# EAGLE design femtoUSB_r1.0.1-rgb (EAGLE 7.5.0)
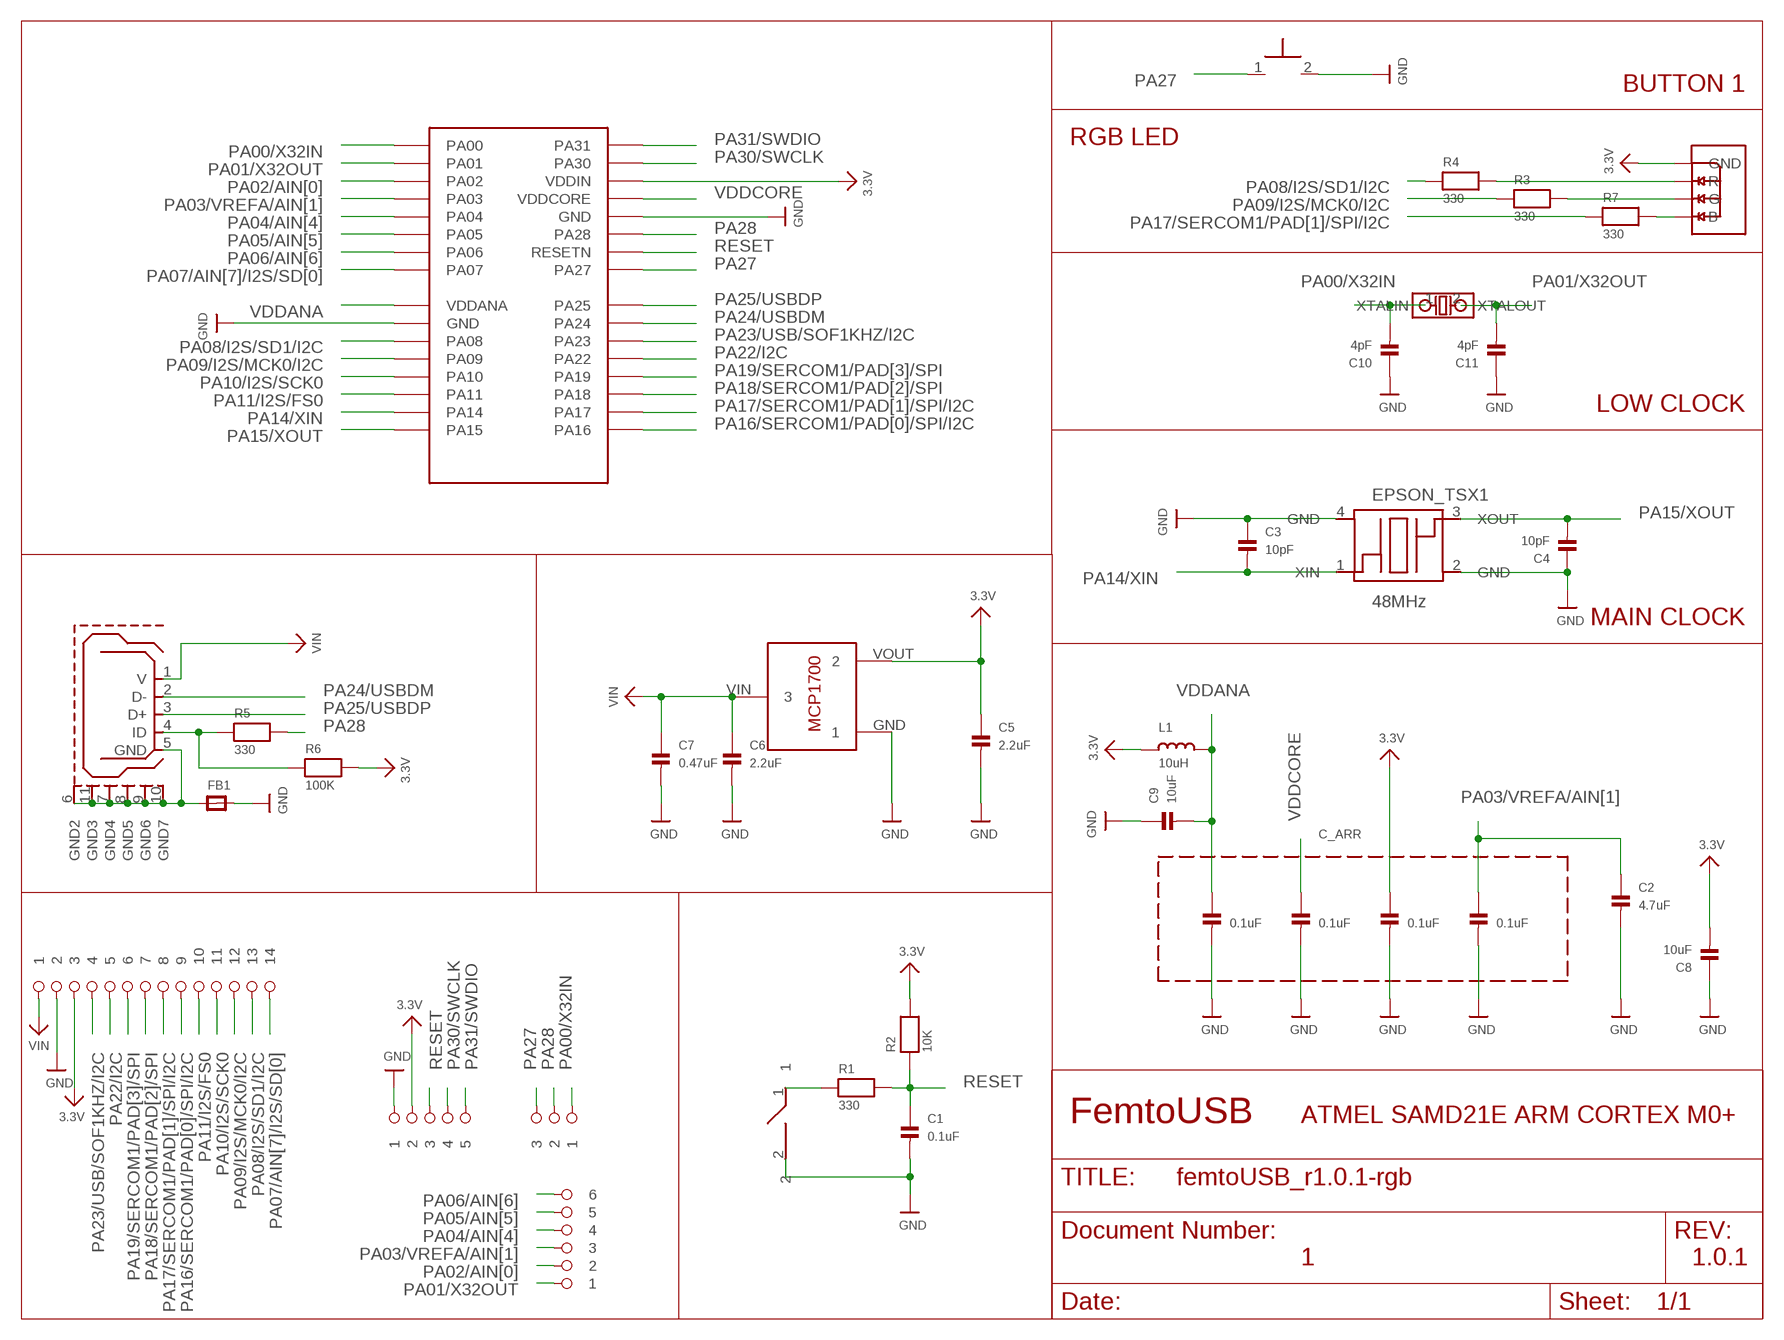
[diagram p0: schematic, sheet 1]

## Parts
BTN_BOOT  TACTILE_SWITCH_NO_GND_NO_BOSS  [SIDE_ACT_NO_GND_NO_BOSS]
C1  0.1uF  CAP_CERAMIC_0402MP  [_0402MP]
C2  4.7uF  CAP_CERAMIC_0402MP  [_0402MP]
C3  10pF  CAP_CERAMIC_0402MP  [_0402MP]
C4  10pF  CAP_CERAMIC_0402MP  [_0402MP]
C5  2.2uF  CAP_CERAMIC_0402MP  [_0402MP]
C6  2.2uF  CAP_CERAMIC_0402MP  [_0402MP]
C7  0.47uF  CAP_CERAMIC_0402MP  [_0402MP]
C8  10uF  CAP_CERAMIC_0402MP  [_0402MP]
C9  10uF  CAP_CERAMIC_0402MP  [_0402MP]
C10  4pF  CAP_CERAMIC_0402MP  [_0402MP]
C11  4pF  CAP_CERAMIC_0402MP  [_0402MP]
C_ARR  0.1uF  KEMET_CERAMIC_CAPACITOR_ARRAY_1X4  [CAPACITOR_ARRAY_1206_MONO_1X4]
EPSON_TSX1  48MHz  TSX-3225  [TSX-3225]
FB1  FERRITE_0603MP  [_0603MP]
IC1  ATSAMD21E18A-MUT  [QFN32]
L1  10uH  INDUCTOR_0603MP  [_0603MP]
LDO_VREG  MCP1700T-3302E/TT  [MCP1700T-3302E/TT]
MICRO_B_USB  USB_MICROB  [USB_MICROB_PACKAGE]
OSC32K  ABS06-107-32.768KHZ-T  [ABS06-107-32.768KHZ-T]
PIN_1X3  1X3_ROUND  [1X3_ROUND]
PIN_1X5  1X5_ROUND  [1X5_ROUND]
PIN_1X6  1X6_ROUND  [1X6_ROUND]
PIN_1X14  1X14_ROUND  [1X14_ROUND]
R1  330  RESISTOR_0402MP  [_0402MP]
R2  10K  RESISTOR_0402MP  [_0402MP]
R3  330  RESISTOR_0402MP  [_0402MP]
R4  330  RESISTOR_0402MP  [_0402MP]
R5  330  RESISTOR_0402MP  [_0402MP]
R6  100K  RESISTOR_0402MP  [_0402MP]
R7  330  RESISTOR_0402MP  [_0402MP]
RGBLED  LRTB_R48G  [LRTB_R48G]
SJ_RESET  SPST_SMD  [SPST_SMD]

## Nets
3.3V: C5.1 C8.2 C_ARR.5 IC1.30(VDDIN) L1.1 LDO_VREG.VOUT PIN_1X5.P$2 PIN_1X14.P$3 R2.2 R6.2 RGBLED.1(GND)
GND: BTN_BOOT.2 C1.2 C2.2 C3.1 C4.1 C5.2 C6.2 C7.2 C8.1 C9.1 C10.1 C11.1 C_ARR.2 C_ARR.4 C_ARR.6 C_ARR.8 EPSON_TSX1.2(GND) EPSON_TSX1.4(GND) FB1.2 IC1.10(GND) IC1.28(GND) LDO_VREG.GND PIN_1X5.P$1 PIN_1X14.P$2 SJ_RESET.2
N$3: MICRO_B_USB.4(ID) R5.1 R6.1
N$26: R1.1 SJ_RESET.1
N$32: FB1.1 MICRO_B_USB.5(GND) MICRO_B_USB.6(GND2) MICRO_B_USB.7(GND4) MICRO_B_USB.8(GND5) MICRO_B_USB.9(GND6) MICRO_B_USB.10(GND7) MICRO_B_USB.11(GND3)
PA00/X32IN: C10.2 IC1.1(PA00) OSC32K.1(XTALIN) PIN_1X3.P$1
PA01/X32OUT: C11.2 IC1.2(PA01) OSC32K.2(XTALOUT) PIN_1X6.P$1
PA02/AIN[0]: IC1.3(PA02) PIN_1X6.P$2
PA03/VREFA/AIN[1]: C2.1 C_ARR.7 IC1.4(PA03) PIN_1X6.P$3
PA04/AIN[4]: IC1.5(PA04) PIN_1X6.P$4
PA05/AIN[5]: IC1.6(PA05) PIN_1X6.P$5
PA06/AIN[6]: IC1.7(PA06) PIN_1X6.P$6
PA07/AIN[7]/I2S/SD[0]: IC1.8(PA07) PIN_1X14.P$14
PA08/I2S/SD1/I2C: IC1.11(PA08) PIN_1X14.P$13 R4.1
PA08_R: R4.2 RGBLED.2(R)
PA09/I2S/MCK0/I2C: IC1.12(PA09) PIN_1X14.P$12 R3.1
PA09_G: R3.2 RGBLED.3(G)
PA10/I2S/SCK0: IC1.13(PA10) PIN_1X14.P$11
PA11/I2S/FS0: IC1.14(PA11) PIN_1X14.P$10
PA14/XIN: C3.2 EPSON_TSX1.1(XIN) IC1.15(PA14)
PA15/XOUT: C4.2 EPSON_TSX1.3(XOUT) IC1.16(PA15)
PA16/SERCOM1/PAD[0]/SPI/I2C: IC1.17(PA16) PIN_1X14.P$9
PA17/SERCOM1/PAD[1]/SPI/I2C: IC1.18(PA17) PIN_1X14.P$8 R7.1
PA17_B: R7.2 RGBLED.4(B)
PA18/SERCOM1/PAD[2]/SPI: IC1.19(PA18) PIN_1X14.P$7
PA19/SERCOM1/PAD[3]/SPI: IC1.20(PA19) PIN_1X14.P$6
PA22/I2C: IC1.21(PA22) PIN_1X14.P$5
PA23/USB/SOF1KHZ/I2C: IC1.22(PA23) PIN_1X14.P$4
PA24/USBDM: IC1.23(PA24) MICRO_B_USB.2(D-)
PA25/USBDP: IC1.24(PA25) MICRO_B_USB.3(D+)
PA27: BTN_BOOT.1 IC1.25(PA27) PIN_1X3.P$3
PA28: IC1.27(PA28) PIN_1X3.P$2 R5.2
PA30/SWCLK: IC1.31(PA30) PIN_1X5.P$4
PA31/SWDIO: IC1.32(PA31) PIN_1X5.P$5
RESET: C1.1 IC1.26(RESETN) PIN_1X5.P$3 R1.2 R2.1
VDDANA: C9.2 C_ARR.1 IC1.9(VDDANA) L1.2
VDDCORE: C_ARR.3 IC1.29(VDDCORE)
VIN: C6.1 C7.1 LDO_VREG.VIN MICRO_B_USB.1(V) PIN_1X14.P$1

## Notes on the sheet
- BUTTON 1
- RGB LED
- LOW CLOCK
- MAIN CLOCK
- FemtoUSB | ATMEL SAMD21E ARM CORTEX M0+
- 1 | 1.0.1

## Library data of the parts
BTN_BOOT = omron_tactile_switch:TACTILE_SWITCH_NO_GND_NO_BOSS; MFR_ID: B3U-3000PM
C1 = microbuilder:CAP_CERAMIC: Ceramic Capacitors 0402 - 0402 Surface Mount Capacitors 16pF 50V 5% [Digikey: 445-4899-2-ND] 18pF 50V 5% [Digikey: 490-1281-2-ND] 22pF 50V 5% [Digikey: 490-1283-2-ND] 68pF 50V 5% [Digikey: 490-1289-2-ND] 0.1uF 10V 10% [Digikey: 490-1318-2-ND] 1.0uF 6.3V 10% [Digikey: 490-1320-2-ND] 0603 - 0603 Surface Mount Capacitors 16 pF 50V 5% [Digikey: 445-5051-2-ND] 22 pF 50V [Digikey: PCC220ACVTR-ND] 33 pF 50V 5% [Digikey: 490-1415-1-ND] 56pF 50V 5% [Digikey: 490-1421-1-ND] 220pF 50V 5% [Digikey: 445-1285-1-ND] 680 pF 50V 2200 pF 50V 5% C0G [Digikey: 445-1297-1-ND] 5600 pF 100V 5% X7R [Digikey: 478-3711-1-ND] 0.1 µF 25V 10% [Digikey: PCC2277TR-ND] 0.22 µF 16V 10% X7R [Digikey: 445-1318-1-ND] 1.0 µF 25V 10% [Digikey: 445-5146-2-ND] 0603 - RF Specific 3pF 250V +/-0.1pF RF [Digikey: 712-1347-1-ND] 18 pF 250V 5% [Digikey: 478-3505-1-ND or 712-1322-1-ND] 56 pF 250V 5% C0G RF [Digikey: 490-4867-1-ND] 68 pF 250V RF [Digikey: 490-4868-1-ND] 0805 - 0805 Surface Mount Capacitors 220 pF 250V 2% RF Ceramic Capacitor [Digikey: 712-1398-1-ND] 1000 pF 50V 2% NP0 Ceramic Capacitor [Digikey: 478-3760-1-ND] 0.1 µF 25V 10% Ceramic Capacitor [Digikey: PCC1828TR-ND] 1.0 µF 16V 10% Ceramic Capacitor[Digikey: 490-1691-2-ND] 10.0 µF 10V 10% Ceramic Capacitor[Digikey: 709-1228-1-ND] 10.0 uF 16V 10% Ceramic Capacitor [Digikey: 478-5165-2-ND] 47 uF 6.3V 20% Ceramic Capacitor [Digikey: 587-1779-1-ND or 399-5506-1-ND] 1206 - 1206 Surface Mount Capacitors 47uF 10V 20% Ceramic Capacitor [Digikey: 490-5528-1-ND or 399-5508-1-ND or 445-6010-1-ND] 100uF 6.3V -20%, +80% Y5V Ceramic Capacitor (Digikey: 490-4512-1-ND, Mouser: 81-GRM31CF50J107ZE1L); MFR_ID: C1005X7R1A104K050BB
C2 = microbuilder:CAP_CERAMIC: Ceramic Capacitors 0402 - 0402 Surface Mount Capacitors 16pF 50V 5% [Digikey: 445-4899-2-ND] 18pF 50V 5% [Digikey: 490-1281-2-ND] 22pF 50V 5% [Digikey: 490-1283-2-ND] 68pF 50V 5% [Digikey: 490-1289-2-ND] 0.1uF 10V 10% [Digikey: 490-1318-2-ND] 1.0uF 6.3V 10% [Digikey: 490-1320-2-ND] 0603 - 0603 Surface Mount Capacitors 16 pF 50V 5% [Digikey: 445-5051-2-ND] 22 pF 50V [Digikey: PCC220ACVTR-ND] 33 pF 50V 5% [Digikey: 490-1415-1-ND] 56pF 50V 5% [Digikey: 490-1421-1-ND] 220pF 50V 5% [Digikey: 445-1285-1-ND] 680 pF 50V 2200 pF 50V 5% C0G [Digikey: 445-1297-1-ND] 5600 pF 100V 5% X7R [Digikey: 478-3711-1-ND] 0.1 µF 25V 10% [Digikey: PCC2277TR-ND] 0.22 µF 16V 10% X7R [Digikey: 445-1318-1-ND] 1.0 µF 25V 10% [Digikey: 445-5146-2-ND] 0603 - RF Specific 3pF 250V +/-0.1pF RF [Digikey: 712-1347-1-ND] 18 pF 250V 5% [Digikey: 478-3505-1-ND or 712-1322-1-ND] 56 pF 250V 5% C0G RF [Digikey: 490-4867-1-ND] 68 pF 250V RF [Digikey: 490-4868-1-ND] 0805 - 0805 Surface Mount Capacitors 220 pF 250V 2% RF Ceramic Capacitor [Digikey: 712-1398-1-ND] 1000 pF 50V 2% NP0 Ceramic Capacitor [Digikey: 478-3760-1-ND] 0.1 µF 25V 10% Ceramic Capacitor [Digikey: PCC1828TR-ND] 1.0 µF 16V 10% Ceramic Capacitor[Digikey: 490-1691-2-ND] 10.0 µF 10V 10% Ceramic Capacitor[Digikey: 709-1228-1-ND] 10.0 uF 16V 10% Ceramic Capacitor [Digikey: 478-5165-2-ND] 47 uF 6.3V 20% Ceramic Capacitor [Digikey: 587-1779-1-ND or 399-5506-1-ND] 1206 - 1206 Surface Mount Capacitors 47uF 10V 20% Ceramic Capacitor [Digikey: 490-5528-1-ND or 399-5508-1-ND or 445-6010-1-ND] 100uF 6.3V -20%, +80% Y5V Ceramic Capacitor (Digikey: 490-4512-1-ND, Mouser: 81-GRM31CF50J107ZE1L); MFR_ID: C1005X5R1A475K050BC
C3 C4 = microbuilder:CAP_CERAMIC: Ceramic Capacitors 0402 - 0402 Surface Mount Capacitors 16pF 50V 5% [Digikey: 445-4899-2-ND] 18pF 50V 5% [Digikey: 490-1281-2-ND] 22pF 50V 5% [Digikey: 490-1283-2-ND] 68pF 50V 5% [Digikey: 490-1289-2-ND] 0.1uF 10V 10% [Digikey: 490-1318-2-ND] 1.0uF 6.3V 10% [Digikey: 490-1320-2-ND] 0603 - 0603 Surface Mount Capacitors 16 pF 50V 5% [Digikey: 445-5051-2-ND] 22 pF 50V [Digikey: PCC220ACVTR-ND] 33 pF 50V 5% [Digikey: 490-1415-1-ND] 56pF 50V 5% [Digikey: 490-1421-1-ND] 220pF 50V 5% [Digikey: 445-1285-1-ND] 680 pF 50V 2200 pF 50V 5% C0G [Digikey: 445-1297-1-ND] 5600 pF 100V 5% X7R [Digikey: 478-3711-1-ND] 0.1 µF 25V 10% [Digikey: PCC2277TR-ND] 0.22 µF 16V 10% X7R [Digikey: 445-1318-1-ND] 1.0 µF 25V 10% [Digikey: 445-5146-2-ND] 0603 - RF Specific 3pF 250V +/-0.1pF RF [Digikey: 712-1347-1-ND] 18 pF 250V 5% [Digikey: 478-3505-1-ND or 712-1322-1-ND] 56 pF 250V 5% C0G RF [Digikey: 490-4867-1-ND] 68 pF 250V RF [Digikey: 490-4868-1-ND] 0805 - 0805 Surface Mount Capacitors 220 pF 250V 2% RF Ceramic Capacitor [Digikey: 712-1398-1-ND] 1000 pF 50V 2% NP0 Ceramic Capacitor [Digikey: 478-3760-1-ND] 0.1 µF 25V 10% Ceramic Capacitor [Digikey: PCC1828TR-ND] 1.0 µF 16V 10% Ceramic Capacitor[Digikey: 490-1691-2-ND] 10.0 µF 10V 10% Ceramic Capacitor[Digikey: 709-1228-1-ND] 10.0 uF 16V 10% Ceramic Capacitor [Digikey: 478-5165-2-ND] 47 uF 6.3V 20% Ceramic Capacitor [Digikey: 587-1779-1-ND or 399-5506-1-ND] 1206 - 1206 Surface Mount Capacitors 47uF 10V 20% Ceramic Capacitor [Digikey: 490-5528-1-ND or 399-5508-1-ND or 445-6010-1-ND] 100uF 6.3V -20%, +80% Y5V Ceramic Capacitor (Digikey: 490-4512-1-ND, Mouser: 81-GRM31CF50J107ZE1L); MFR_ID: VJ0402A100FXACW1BC
C5 C6 = microbuilder:CAP_CERAMIC: Ceramic Capacitors 0402 - 0402 Surface Mount Capacitors 16pF 50V 5% [Digikey: 445-4899-2-ND] 18pF 50V 5% [Digikey: 490-1281-2-ND] 22pF 50V 5% [Digikey: 490-1283-2-ND] 68pF 50V 5% [Digikey: 490-1289-2-ND] 0.1uF 10V 10% [Digikey: 490-1318-2-ND] 1.0uF 6.3V 10% [Digikey: 490-1320-2-ND] 0603 - 0603 Surface Mount Capacitors 16 pF 50V 5% [Digikey: 445-5051-2-ND] 22 pF 50V [Digikey: PCC220ACVTR-ND] 33 pF 50V 5% [Digikey: 490-1415-1-ND] 56pF 50V 5% [Digikey: 490-1421-1-ND] 220pF 50V 5% [Digikey: 445-1285-1-ND] 680 pF 50V 2200 pF 50V 5% C0G [Digikey: 445-1297-1-ND] 5600 pF 100V 5% X7R [Digikey: 478-3711-1-ND] 0.1 µF 25V 10% [Digikey: PCC2277TR-ND] 0.22 µF 16V 10% X7R [Digikey: 445-1318-1-ND] 1.0 µF 25V 10% [Digikey: 445-5146-2-ND] 0603 - RF Specific 3pF 250V +/-0.1pF RF [Digikey: 712-1347-1-ND] 18 pF 250V 5% [Digikey: 478-3505-1-ND or 712-1322-1-ND] 56 pF 250V 5% C0G RF [Digikey: 490-4867-1-ND] 68 pF 250V RF [Digikey: 490-4868-1-ND] 0805 - 0805 Surface Mount Capacitors 220 pF 250V 2% RF Ceramic Capacitor [Digikey: 712-1398-1-ND] 1000 pF 50V 2% NP0 Ceramic Capacitor [Digikey: 478-3760-1-ND] 0.1 µF 25V 10% Ceramic Capacitor [Digikey: PCC1828TR-ND] 1.0 µF 16V 10% Ceramic Capacitor[Digikey: 490-1691-2-ND] 10.0 µF 10V 10% Ceramic Capacitor[Digikey: 709-1228-1-ND] 10.0 uF 16V 10% Ceramic Capacitor [Digikey: 478-5165-2-ND] 47 uF 6.3V 20% Ceramic Capacitor [Digikey: 587-1779-1-ND or 399-5506-1-ND] 1206 - 1206 Surface Mount Capacitors 47uF 10V 20% Ceramic Capacitor [Digikey: 490-5528-1-ND or 399-5508-1-ND or 445-6010-1-ND] 100uF 6.3V -20%, +80% Y5V Ceramic Capacitor (Digikey: 490-4512-1-ND, Mouser: 81-GRM31CF50J107ZE1L); MFR_ID: C1005X5R1C225K050BC
C7 = microbuilder:CAP_CERAMIC: Ceramic Capacitors 0402 - 0402 Surface Mount Capacitors 16pF 50V 5% [Digikey: 445-4899-2-ND] 18pF 50V 5% [Digikey: 490-1281-2-ND] 22pF 50V 5% [Digikey: 490-1283-2-ND] 68pF 50V 5% [Digikey: 490-1289-2-ND] 0.1uF 10V 10% [Digikey: 490-1318-2-ND] 1.0uF 6.3V 10% [Digikey: 490-1320-2-ND] 0603 - 0603 Surface Mount Capacitors 16 pF 50V 5% [Digikey: 445-5051-2-ND] 22 pF 50V [Digikey: PCC220ACVTR-ND] 33 pF 50V 5% [Digikey: 490-1415-1-ND] 56pF 50V 5% [Digikey: 490-1421-1-ND] 220pF 50V 5% [Digikey: 445-1285-1-ND] 680 pF 50V 2200 pF 50V 5% C0G [Digikey: 445-1297-1-ND] 5600 pF 100V 5% X7R [Digikey: 478-3711-1-ND] 0.1 µF 25V 10% [Digikey: PCC2277TR-ND] 0.22 µF 16V 10% X7R [Digikey: 445-1318-1-ND] 1.0 µF 25V 10% [Digikey: 445-5146-2-ND] 0603 - RF Specific 3pF 250V +/-0.1pF RF [Digikey: 712-1347-1-ND] 18 pF 250V 5% [Digikey: 478-3505-1-ND or 712-1322-1-ND] 56 pF 250V 5% C0G RF [Digikey: 490-4867-1-ND] 68 pF 250V RF [Digikey: 490-4868-1-ND] 0805 - 0805 Surface Mount Capacitors 220 pF 250V 2% RF Ceramic Capacitor [Digikey: 712-1398-1-ND] 1000 pF 50V 2% NP0 Ceramic Capacitor [Digikey: 478-3760-1-ND] 0.1 µF 25V 10% Ceramic Capacitor [Digikey: PCC1828TR-ND] 1.0 µF 16V 10% Ceramic Capacitor[Digikey: 490-1691-2-ND] 10.0 µF 10V 10% Ceramic Capacitor[Digikey: 709-1228-1-ND] 10.0 uF 16V 10% Ceramic Capacitor [Digikey: 478-5165-2-ND] 47 uF 6.3V 20% Ceramic Capacitor [Digikey: 587-1779-1-ND or 399-5506-1-ND] 1206 - 1206 Surface Mount Capacitors 47uF 10V 20% Ceramic Capacitor [Digikey: 490-5528-1-ND or 399-5508-1-ND or 445-6010-1-ND] 100uF 6.3V -20%, +80% Y5V Ceramic Capacitor (Digikey: 490-4512-1-ND, Mouser: 81-GRM31CF50J107ZE1L); MFR_ID: C1005X5R1C474K050BC
C8 C9 = microbuilder:CAP_CERAMIC: Ceramic Capacitors 0402 - 0402 Surface Mount Capacitors 16pF 50V 5% [Digikey: 445-4899-2-ND] 18pF 50V 5% [Digikey: 490-1281-2-ND] 22pF 50V 5% [Digikey: 490-1283-2-ND] 68pF 50V 5% [Digikey: 490-1289-2-ND] 0.1uF 10V 10% [Digikey: 490-1318-2-ND] 1.0uF 6.3V 10% [Digikey: 490-1320-2-ND] 0603 - 0603 Surface Mount Capacitors 16 pF 50V 5% [Digikey: 445-5051-2-ND] 22 pF 50V [Digikey: PCC220ACVTR-ND] 33 pF 50V 5% [Digikey: 490-1415-1-ND] 56pF 50V 5% [Digikey: 490-1421-1-ND] 220pF 50V 5% [Digikey: 445-1285-1-ND] 680 pF 50V 2200 pF 50V 5% C0G [Digikey: 445-1297-1-ND] 5600 pF 100V 5% X7R [Digikey: 478-3711-1-ND] 0.1 µF 25V 10% [Digikey: PCC2277TR-ND] 0.22 µF 16V 10% X7R [Digikey: 445-1318-1-ND] 1.0 µF 25V 10% [Digikey: 445-5146-2-ND] 0603 - RF Specific 3pF 250V +/-0.1pF RF [Digikey: 712-1347-1-ND] 18 pF 250V 5% [Digikey: 478-3505-1-ND or 712-1322-1-ND] 56 pF 250V 5% C0G RF [Digikey: 490-4867-1-ND] 68 pF 250V RF [Digikey: 490-4868-1-ND] 0805 - 0805 Surface Mount Capacitors 220 pF 250V 2% RF Ceramic Capacitor [Digikey: 712-1398-1-ND] 1000 pF 50V 2% NP0 Ceramic Capacitor [Digikey: 478-3760-1-ND] 0.1 µF 25V 10% Ceramic Capacitor [Digikey: PCC1828TR-ND] 1.0 µF 16V 10% Ceramic Capacitor[Digikey: 490-1691-2-ND] 10.0 µF 10V 10% Ceramic Capacitor[Digikey: 709-1228-1-ND] 10.0 uF 16V 10% Ceramic Capacitor [Digikey: 478-5165-2-ND] 47 uF 6.3V 20% Ceramic Capacitor [Digikey: 587-1779-1-ND or 399-5506-1-ND] 1206 - 1206 Surface Mount Capacitors 47uF 10V 20% Ceramic Capacitor [Digikey: 490-5528-1-ND or 399-5508-1-ND or 445-6010-1-ND] 100uF 6.3V -20%, +80% Y5V Ceramic Capacitor (Digikey: 490-4512-1-ND, Mouser: 81-GRM31CF50J107ZE1L); MFR_ID: CL05A106MP5NUNC
C10 C11 = microbuilder:CAP_CERAMIC: Ceramic Capacitors 0402 - 0402 Surface Mount Capacitors 16pF 50V 5% [Digikey: 445-4899-2-ND] 18pF 50V 5% [Digikey: 490-1281-2-ND] 22pF 50V 5% [Digikey: 490-1283-2-ND] 68pF 50V 5% [Digikey: 490-1289-2-ND] 0.1uF 10V 10% [Digikey: 490-1318-2-ND] 1.0uF 6.3V 10% [Digikey: 490-1320-2-ND] 0603 - 0603 Surface Mount Capacitors 16 pF 50V 5% [Digikey: 445-5051-2-ND] 22 pF 50V [Digikey: PCC220ACVTR-ND] 33 pF 50V 5% [Digikey: 490-1415-1-ND] 56pF 50V 5% [Digikey: 490-1421-1-ND] 220pF 50V 5% [Digikey: 445-1285-1-ND] 680 pF 50V 2200 pF 50V 5% C0G [Digikey: 445-1297-1-ND] 5600 pF 100V 5% X7R [Digikey: 478-3711-1-ND] 0.1 µF 25V 10% [Digikey: PCC2277TR-ND] 0.22 µF 16V 10% X7R [Digikey: 445-1318-1-ND] 1.0 µF 25V 10% [Digikey: 445-5146-2-ND] 0603 - RF Specific 3pF 250V +/-0.1pF RF [Digikey: 712-1347-1-ND] 18 pF 250V 5% [Digikey: 478-3505-1-ND or 712-1322-1-ND] 56 pF 250V 5% C0G RF [Digikey: 490-4867-1-ND] 68 pF 250V RF [Digikey: 490-4868-1-ND] 0805 - 0805 Surface Mount Capacitors 220 pF 250V 2% RF Ceramic Capacitor [Digikey: 712-1398-1-ND] 1000 pF 50V 2% NP0 Ceramic Capacitor [Digikey: 478-3760-1-ND] 0.1 µF 25V 10% Ceramic Capacitor [Digikey: PCC1828TR-ND] 1.0 µF 16V 10% Ceramic Capacitor[Digikey: 490-1691-2-ND] 10.0 µF 10V 10% Ceramic Capacitor[Digikey: 709-1228-1-ND] 10.0 uF 16V 10% Ceramic Capacitor [Digikey: 478-5165-2-ND] 47 uF 6.3V 20% Ceramic Capacitor [Digikey: 587-1779-1-ND or 399-5506-1-ND] 1206 - 1206 Surface Mount Capacitors 47uF 10V 20% Ceramic Capacitor [Digikey: 490-5528-1-ND or 399-5508-1-ND or 445-6010-1-ND] 100uF 6.3V -20%, +80% Y5V Ceramic Capacitor (Digikey: 490-4512-1-ND, Mouser: 81-GRM31CF50J107ZE1L); MFR_ID: GJM1555C1H4R0CB01D
C_ARR = array-capacitor:KEMET_CERAMIC_CAPACITOR_ARRAY_1X4; MFR_ID: CA064C104K4RACTU
EPSON_TSX1 = crystals:TSX-3225; MFR_ID: FA-238 48.0000MB-K3
FB1 = microbuilder:FERRITE: Ferrite Bead 0603 MMZ1608B121C - 120 Ohm @ 100MHz, 600mA, 0.15 Ohm DC Resistance - Digikey: 445-2164-1-ND BK1608HW121-T - 120 Ohm, 600mA Ferrite Chip - Digikey: 587-1876-2-ND 0805 HZ0805B272R-10 - 2.7K Ohm @ 100MHz, 200mA, 0.8 Ohm DC Resistance - Digikey: 240-2504-1-ND (see also Murata BLM21BD272SN1L) MMZ2012Y152B - 1.5K Ohm @ 100MHz, 500mA, 0.4 Ohm DC Resistance - Digikey: 445-1560-1-ND - Mainly for high frequency (80-400MHz) MMZ2012R102A - 1K Ohm @ 100MHz, 500mA, 0.3 Ohm DC Resistance - Digikey: 445-1555-2-ND - More general purpose (10-200MHz); MFR_ID: BLM18RK102SN1D
IC1 = atmel-samd21:ATSAMD21E18A-MUT: This is the ATMEL SAMD21E QFN-32. ATSAMD21E18A; MFR_ID: ATSAMD21E18A-MUT
L1 = microbuilder:INDUCTOR: Inductors 0603: 10nH Ceramic Inductor - microwire antenna/RF (Digikey: 712-1434-2-ND) 0805: 560nH Ceramic Inductor - RF (Digikey: 553-1047-1-ND) 270nH Ceramic Inductor - Q = 40@250MHz, +-5%, 1 Ohm DC Resistance (Digikey: 535-10506-2-ND) 1007 (2518 Metric) SMT: 10µH 10% 250mOhm 820mA 1007 Inductor (Digikey: 587-2189-1-ND) 22µH 10% 500mOhm 580mA 1007 Inductor (Digikey: 587-2190-1-ND) 47µH 10% 950mOhm 420mA 1007 Inductor (Digikey: 587-2191-1-ND) 47µH 5% 100mOhm 1A 1008 Inductor (Digikey: 732-1816-1-ND) 5.0x5.0mm (Taiyo Yuden NR5040 Series) 6.8µH 20% 2.3A 64mOhm Inductor (Digikey: 587-2374-2-ND) 5.0x5.0mm (TDK VLC5045 Series) 4.7µH 20% 3.3A 34mOhm Inductor (Digikey: 445-6526-1-ND) 6.8µH 20% 2.7A 46mOhm Inductor (Digikey: 445-6527-1-ND) 6.0x6.0mm (TDK VLC6045 Series) 4.7µH 20% 3.8A 27mOhm Inductor (Digikey: 445-6538-2-ND) 6.8µH 20% 3A 41mOhm Inductor (Digikey: 445-6540-1-ND) 6.2µH 30% 2.2A 45mOhm Inductor (Digikey: SRR5028-6R2YCT-ND) - Not TDK VLC6045 but footprint should match 6.0x6.0mm (TDK SLF6045 Series) 6.8uH 30% 2A 33mOhm Inductor (Digikey: 445-4572-1-ND, Mouser: 810-SLF645T6R8N2R0PF); MFR_ID: LQM18FN100M00D
LDO_VREG = MCP1700T-3302E_TT:MCP1700T-3302E/TT: Microchip LDO "MCP1700" in a 3-Pin SOT-23 package. ID: MCP1700T-3302E/TT; MFR_ID: MCP1700T-3302E/TT
MICRO_B_USB = femtoduino:USB_MICROB: This is the hirose ZX62-B-5PA(11) MICRO-USB B Type female connection.; MFR_ID: ZX62-B-5PA(11)
OSC32K = crystals:ABS06-107-32.768KHZ-T: ABS06-107-32.768kHz-T Crystal Oscillator; MFR_ID: ABS06-107-32.768kHz-T
PIN_1X3 = pins_1.27mm_pitch:1X3_ROUND
PIN_1X5 = pins_1.27mm_pitch:1X5_ROUND
PIN_1X6 = pins_1.27mm_pitch:1X6_ROUND
PIN_1X14 = pins_1.27mm_pitch:1X14_ROUND
R1 R3-R5 R7 = microbuilder:RESISTOR: Resistors 0402 - 0402 Surface Mount Package 22 Ohm 1% 1/16W [Digikey: 311-22.0LRTR-ND] 33 Ohm 5% 1/16W 1.0K 5% 1/16W 1.5K 5% 1/16W 2.0K 1% 1/16W 10.0K 1% 1/16W [Digikey: 311-10.0KLRTR-ND] 10.0K 5% 1/16W [Digikey: RMCF0402JT10K0TR-ND] 12.1K 1% 1/16W [Digikey: 311-22.0LRTR-ND] 100.0K 5% 1/16W 0603 - 0603 Surface Mount Package 0 Ohm 1/10 Watt 1% Resistor 15 Ohm 1/10 Watt 1% Resistor 33 Ohm 1/10 Watt 1% Resistor 49.9 Ohm 1/10 Watt 1% Resistor 100 Ohm 1/10 Watt 1% Resistor 150 Ohm 1/10 Watt 1% Resistor 240 Ohm 1/10 Watt 1% Resistor 390 Ohm 1/10 Watt 1% Resistor 560 Ohm 1/10 Watt 1% Resistor 680 Ohm 1/10 Watt 1% Resistor 750 Ohm 1/10 Watt 1% Resistor 1.0K Ohm 1/10 Watt 1% Resistor 1.5K Ohm 1/10 Watt 1% Resistor 2.0K Ohm 1/10 Watt 1% Resistor 2.2K Ohm 1/10 Watt 1% Resistor 3.3K Ohm 1/10 Watt 1% Resistor 4.7K Ohm 1/10 Watt 1% Resistor 10.0K Ohm 1/10 Watt 1% Resistor 12.0K Ohm 1/10 Watt 1% Resistor 12.1K Ohm 1/10 Watt 1% Resistor 20.0K Ohm 1/10 Watt 1% Resistor 33.0K Ohm 1/10 Watt 1% Resistor 100.0K Ohm 1/10 Watt 1% Resistor 0805 - 0805 Surface Mount Package 0 Ohm 1/8 Watt 1% Resistor 33 Ohm 1/8 Watt 1% Resistor 100 Ohm 1/8 Watt 1% Resistor 150 Ohm 1/8 Watt 1% Resistor 200 Ohm 1/8 Watt 1% Resistor 240 Ohm 1/8 Watt 1% Resistor 330 Ohm 1/8 Watt 1% Resistor 390 Ohm 1/8 Watt 1% Resistor 470 Ohm 1/8 Watt 1% Resistor 1.0K Ohm 1/8 Watt 1% Resistor 1.5K Ohm 1/8 Watt 1% Resistor 2.0K Ohm 1/8 Watt 1% Resistor 4.7K Ohm 1/8 Watt 1% Resistor 5.1K Ohm 1/8 Watt 1% Resistor 5.6K Ohm 1/8 Watt 1% Resistor 10.0K Ohm 1/8 Watt 1% Resistor 22.0K Ohm 1/8 Watt 1% Resistor 33.0K Ohm 1/8 Watt 1% Resistor 100K Ohm 1/8 Watt 1% Resistor 1206 - 1206 Surface Mount Package 2012 - 2010 Surface Mount Package 0.11 Ohm 1/2 Watt 1% Resistor - Digikey: RHM.11UCT-ND; MFR_ID: CRCW0402330RJNED
R2 = microbuilder:RESISTOR: Resistors 0402 - 0402 Surface Mount Package 22 Ohm 1% 1/16W [Digikey: 311-22.0LRTR-ND] 33 Ohm 5% 1/16W 1.0K 5% 1/16W 1.5K 5% 1/16W 2.0K 1% 1/16W 10.0K 1% 1/16W [Digikey: 311-10.0KLRTR-ND] 10.0K 5% 1/16W [Digikey: RMCF0402JT10K0TR-ND] 12.1K 1% 1/16W [Digikey: 311-22.0LRTR-ND] 100.0K 5% 1/16W 0603 - 0603 Surface Mount Package 0 Ohm 1/10 Watt 1% Resistor 15 Ohm 1/10 Watt 1% Resistor 33 Ohm 1/10 Watt 1% Resistor 49.9 Ohm 1/10 Watt 1% Resistor 100 Ohm 1/10 Watt 1% Resistor 150 Ohm 1/10 Watt 1% Resistor 240 Ohm 1/10 Watt 1% Resistor 390 Ohm 1/10 Watt 1% Resistor 560 Ohm 1/10 Watt 1% Resistor 680 Ohm 1/10 Watt 1% Resistor 750 Ohm 1/10 Watt 1% Resistor 1.0K Ohm 1/10 Watt 1% Resistor 1.5K Ohm 1/10 Watt 1% Resistor 2.0K Ohm 1/10 Watt 1% Resistor 2.2K Ohm 1/10 Watt 1% Resistor 3.3K Ohm 1/10 Watt 1% Resistor 4.7K Ohm 1/10 Watt 1% Resistor 10.0K Ohm 1/10 Watt 1% Resistor 12.0K Ohm 1/10 Watt 1% Resistor 12.1K Ohm 1/10 Watt 1% Resistor 20.0K Ohm 1/10 Watt 1% Resistor 33.0K Ohm 1/10 Watt 1% Resistor 100.0K Ohm 1/10 Watt 1% Resistor 0805 - 0805 Surface Mount Package 0 Ohm 1/8 Watt 1% Resistor 33 Ohm 1/8 Watt 1% Resistor 100 Ohm 1/8 Watt 1% Resistor 150 Ohm 1/8 Watt 1% Resistor 200 Ohm 1/8 Watt 1% Resistor 240 Ohm 1/8 Watt 1% Resistor 330 Ohm 1/8 Watt 1% Resistor 390 Ohm 1/8 Watt 1% Resistor 470 Ohm 1/8 Watt 1% Resistor 1.0K Ohm 1/8 Watt 1% Resistor 1.5K Ohm 1/8 Watt 1% Resistor 2.0K Ohm 1/8 Watt 1% Resistor 4.7K Ohm 1/8 Watt 1% Resistor 5.1K Ohm 1/8 Watt 1% Resistor 5.6K Ohm 1/8 Watt 1% Resistor 10.0K Ohm 1/8 Watt 1% Resistor 22.0K Ohm 1/8 Watt 1% Resistor 33.0K Ohm 1/8 Watt 1% Resistor 100K Ohm 1/8 Watt 1% Resistor 1206 - 1206 Surface Mount Package 2012 - 2010 Surface Mount Package 0.11 Ohm 1/2 Watt 1% Resistor - Digikey: RHM.11UCT-ND; MFR_ID: CRCW040210K0JNEDHP
R6 = microbuilder:RESISTOR: Resistors 0402 - 0402 Surface Mount Package 22 Ohm 1% 1/16W [Digikey: 311-22.0LRTR-ND] 33 Ohm 5% 1/16W 1.0K 5% 1/16W 1.5K 5% 1/16W 2.0K 1% 1/16W 10.0K 1% 1/16W [Digikey: 311-10.0KLRTR-ND] 10.0K 5% 1/16W [Digikey: RMCF0402JT10K0TR-ND] 12.1K 1% 1/16W [Digikey: 311-22.0LRTR-ND] 100.0K 5% 1/16W 0603 - 0603 Surface Mount Package 0 Ohm 1/10 Watt 1% Resistor 15 Ohm 1/10 Watt 1% Resistor 33 Ohm 1/10 Watt 1% Resistor 49.9 Ohm 1/10 Watt 1% Resistor 100 Ohm 1/10 Watt 1% Resistor 150 Ohm 1/10 Watt 1% Resistor 240 Ohm 1/10 Watt 1% Resistor 390 Ohm 1/10 Watt 1% Resistor 560 Ohm 1/10 Watt 1% Resistor 680 Ohm 1/10 Watt 1% Resistor 750 Ohm 1/10 Watt 1% Resistor 1.0K Ohm 1/10 Watt 1% Resistor 1.5K Ohm 1/10 Watt 1% Resistor 2.0K Ohm 1/10 Watt 1% Resistor 2.2K Ohm 1/10 Watt 1% Resistor 3.3K Ohm 1/10 Watt 1% Resistor 4.7K Ohm 1/10 Watt 1% Resistor 10.0K Ohm 1/10 Watt 1% Resistor 12.0K Ohm 1/10 Watt 1% Resistor 12.1K Ohm 1/10 Watt 1% Resistor 20.0K Ohm 1/10 Watt 1% Resistor 33.0K Ohm 1/10 Watt 1% Resistor 100.0K Ohm 1/10 Watt 1% Resistor 0805 - 0805 Surface Mount Package 0 Ohm 1/8 Watt 1% Resistor 33 Ohm 1/8 Watt 1% Resistor 100 Ohm 1/8 Watt 1% Resistor 150 Ohm 1/8 Watt 1% Resistor 200 Ohm 1/8 Watt 1% Resistor 240 Ohm 1/8 Watt 1% Resistor 330 Ohm 1/8 Watt 1% Resistor 390 Ohm 1/8 Watt 1% Resistor 470 Ohm 1/8 Watt 1% Resistor 1.0K Ohm 1/8 Watt 1% Resistor 1.5K Ohm 1/8 Watt 1% Resistor 2.0K Ohm 1/8 Watt 1% Resistor 4.7K Ohm 1/8 Watt 1% Resistor 5.1K Ohm 1/8 Watt 1% Resistor 5.6K Ohm 1/8 Watt 1% Resistor 10.0K Ohm 1/8 Watt 1% Resistor 22.0K Ohm 1/8 Watt 1% Resistor 33.0K Ohm 1/8 Watt 1% Resistor 100K Ohm 1/8 Watt 1% Resistor 1206 - 1206 Surface Mount Package 2012 - 2010 Surface Mount Package 0.11 Ohm 1/2 Watt 1% Resistor - Digikey: RHM.11UCT-ND; MFR_ID: ERJ-2RKF1003X
RGBLED = osram_opto_LED:LRTB_R48G; MFR_ID: LRTB R48G
SJ_RESET = femtoduino:SPST_SMD

## Board
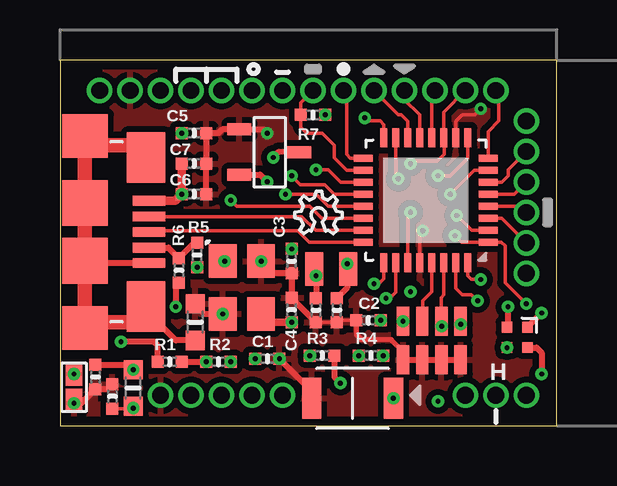
[diagram p1: board, top side]
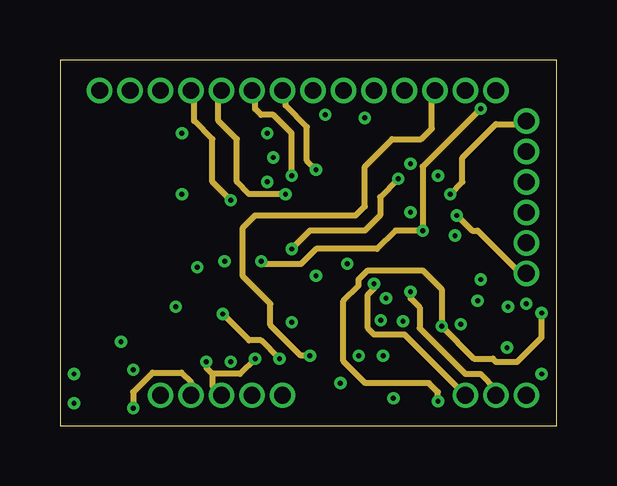
[diagram p2: board, inner layer Route2]
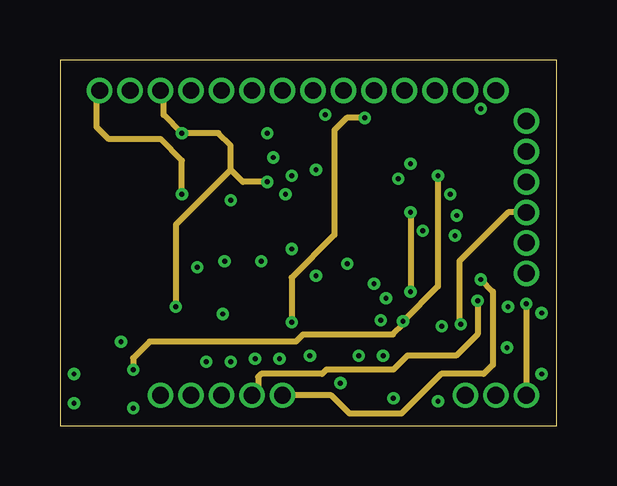
[diagram p3: board, inner layer Route15]
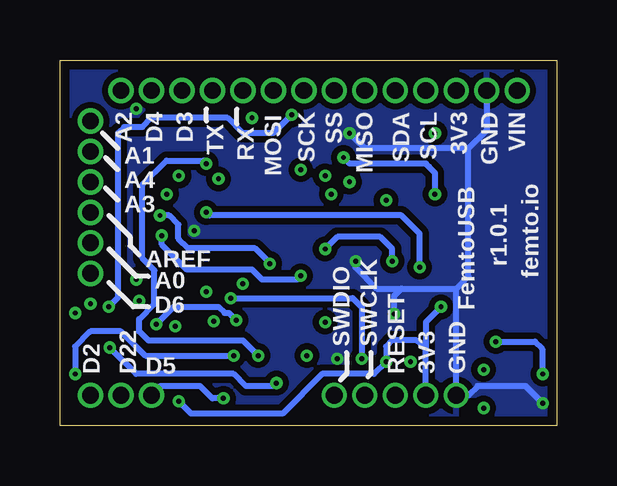
[diagram p4: board, bottom side, seen from below]

Size 20.7 x 15.24 mm. Coordinates in mm from the lower left corner, seen from the top.
Outline: 0,0 20.7,0 20.7,15.24 0,15.24 0,0
Copper layers (1+2*15+16): Top 0.035mm / dielectric 0.7mm / Route2 0.035mm / dielectric 0.15mm / Route15 0.035mm / dielectric 0.2mm / Bottom 0.035mm
Design rules "AQS_custom_4layer": minimum track width 5mil, minimum drill 5mil, track to track 6mil, track to pad 6mil, pad to pad 6mil, via to via 6mil, smd to smd 1mil, copper to edge 15mil, drill to drill 6mil, minimum pad ring 7mil, minimum via ring 3mil, stop-mask expansion 2mil, vias tented up to drill 10mil, thermal gap 10mil

### Footprints (pad centres in the part's own frame; a part is rotated, then mirrored left to right if it is on the bottom)
SIDE_ACT_NO_GND_NO_BOSS = smd 0.8 x 1.7: 1 -1.7,0; 2 1.7,0
_0402MP = smd 0.5 x 0.5: 1 -0.508,0; 2 0.508,0
CAPACITOR_ARRAY_1206_MONO_1X4 = smd 0.52 x 1.2: 1 -1.2,0.8; 2 -1.2,-0.8; 3 -0.4,0.8; 4 -0.4,-0.8; 5 0.4,0.8; 6 0.4,-0.8; 7 1.2,0.8; 8 1.2,-0.8
TSX-3225 = smd 1.4 x 1.15: 1 -1.1,-0.8; 2 1.1,-0.8; 3 1.1,0.8; 4 -1.1,0.8
_0603MP = smd 0.8 x 0.8: 1 -0.762,0; 2 0.762,0
QFN32 = smd 0.8 x 0.3: 1 -2.6,1.75; 2 -2.6,1.25; 3 -2.6,0.75; 4 -2.6,0.25; 5 -2.6,-0.25; 6 -2.6,-0.75; 7 -2.6,-1.25; 8 -2.6,-1.75; 17 2.6,-1.75; 18 2.6,-1.25; 19 2.6,-0.75; 20 2.6,-0.25; 21 2.6,0.25; 22 2.6,0.75; 23 2.6,1.25; 24 2.6,1.75 | smd 0.3 x 0.8: 9 -1.75,-2.6; 10 -1.25,-2.6; 11 -0.75,-2.6; 12 -0.25,-2.6; 13 0.25,-2.6; 14 0.75,-2.6; 15 1.25,-2.6; 16 1.75,-2.6; 25 1.75,2.6; 26 1.25,2.6; 27 0.75,2.6; 28 0.25,2.6; 29 -0.25,2.6; 30 -0.75,2.6; 31 -1.25,2.6; 32 -1.75,2.6
MCP1700T-3302E/TT = smd 0.5 x 1: GND -0.95,-1.25; VIN 0,1.25; VOUT 0.95,-1.25
USB_MICROB_PACKAGE = smd 0.4 x 1.35: 1 -1.3,1.47; 2 -0.64,1.47; 3 0,1.47; 4 0.66,1.47; 5 1.3,1.47 | smd 2.1 x 1.6: 6 -3.1,1.35; 11 3.1,1.35 | smd 1.8 x 1.9: 7 -4,-1.2; 10 4,-1.2 | smd 1.9 x 1.9: 8 -1.2,-1.2; 9 1.2,-1.2
ABS06-107-32.768KHZ-T = smd 0.75 x 1.4: 1 -0.7,0; 2 0.7,0
1X3_ROUND = drill 0.7 pad 1: P$1 0,0; P$2 0,-1.27; P$3 0,-2.54
1X5_ROUND = drill 0.7 pad 1: P$1 0,0; P$2 0,-1.27; P$3 0,-2.54; P$4 0,-3.81; P$5 0,-5.08
1X6_ROUND = drill 0.7 pad 1: P$1 0,0; P$2 0,-1.27; P$3 0,-2.54; P$4 0,-3.81; P$5 0,-5.08; P$6 0,-6.35
1X14_ROUND = drill 0.7 pad 1: P$1 0,0; P$2 0,-1.27; P$3 0,-2.54; P$4 0,-3.81; P$5 0,-5.08; P$6 0,-6.35; P$7 0,-7.62; P$8 0,-8.89; P$9 0,-10.16; P$10 0,-11.43; P$11 0,-12.7; P$12 0,-13.97; P$13 0,-15.24; P$14 0,-16.51
LRTB_R48G = smd 0.45 x 0.45: 1 0.425,0.425; 2 0.425,-0.425; 3 -0.425,-0.425; 4 -0.425,0.425
SPST_SMD = smd 0.889 x 0.699: 1 -0.508,0; 2 0.508,0

### Placement (x,y rotation side)
BTN_BOOT  12.19,1.14 180 top
C1  8.64,2.79 0 top
C2  12.85,4.39 180 top
C3  9.65,6.86 90 top
C4  9.65,4.83 270 top
C5  5.59,12.19 0 top
C6  5.59,9.65 0 top
C7  5.59,10.92 0 top
C8  2.18,1.22 270 top
C9  1.47,2.03 90 top
C10  10.66,4.81 90 top
C11  11.53,4.81 90 top
C_ARR  15.49,3.56 0 top
EPSON_TSX1  7.58,5.76 270 top
FB1  5.64,4.32 90 top
IC1  15.24,9.4 180 top
L1  3.05,1.57 90 top
LDO_VREG  8.73,11.4 270 top
MICRO_B_USB  2.24,8.08 270 top
OSC32K  11.3,6.52 0 top
PIN_1X3  19.43,1.27 270 top
PIN_1X5  4.19,1.27 90 top
PIN_1X6  19.43,6.35 180 top
PIN_1X14  1.65,13.97 90 top
R1  4.57,2.67 0 top
R2  6.6,2.67 0 top
R3  10.92,2.92 0 top
R4  12.95,2.92 0 top
R5  5.71,7.11 270 top
R6  4.95,6.48 270 top
R7  10.54,12.95 0 top
RGBLED  19.05,3.68 0 top
SJ_RESET  0.58,1.6 270 top
U$35  [OSHW_6X70_NOTEXT]  9.78,8 0 top

### Tracks (layer width: path | path; a pad name or v marks a point on that pad's centre or on a via)
3.3V  (via drill 0.2 pad 0.51)
  Top 0.152: IC1.30 15.99,5.45 15.88,5.33 15.88,4.5 C_ARR.5 | C8.2 2.95,0.71 v3.05,0.74 L1.1
  Top 0.254: LDO_VREG.VOUT 8.34,10.46 v8.64,10.16 | R6.2 4.83,5.71 v4.83,4.95 | RGBLED.1 v20.07,4.7
  Top 0.406: C_ARR.5 v15.9,4.14
  Route2 0.254: PIN_1X5.P$2 5.46,1.8 5.05,2.21 3.86,2.21 3.05,1.4 v3.05,0.74 | v20.07,4.7 20.07,3.68 19.05,2.67 18.16,2.67 18.03,2.79 17.25,2.79 v15.9,4.14 15.9,5.69 15.11,6.48 12.83,6.48 12.45,6.1 12.45,5.84 11.81,5.21 11.81,2.69 12.72,1.78 15.37,1.78 15.75,1.4 v15.75,1.02
  Route15 0.254: PIN_1X14.P$3 4.32,13.84 4.32,12.95 C5.1 6.6,12.19 7.11,11.68 7.11,10.67 | v8.64,10.16 7.62,10.16 7.11,10.67 | 7.11,10.67 4.83,8.38 v4.83,4.95
  Bottom 0.254: PIN_1X5.P$2 5.46,3.17 | 5.46,3.17 5.84,3.56 6.86,3.56 7.11,3.3 R2.2 7.62,2.16 9.78,2.16 11.43,0.51 15.24,0.51 v15.75,1.02 | v4.83,4.95 5.46,4.32 5.46,3.17
  other vias: 5.08,12.19 7.11,2.67
GND  (via drill 0.2 pad 0.51)
  Top 0.152: SJ_RESET.2 v0.58,0.94 | 8.89,6.35 EPSON_TSX1.4 | IC1.10 16.49,12.68 16.76,12.95 17.27,12.95 v17.53,13.21 | IC1.28 14.99,8.01 v15.11,8.13 | C4.1 9.65,5.32 | C10.1 C11.1 11.62,4.39 C2.2
  Top 0.203: C2.2 12.34,3.81 12.57,3.59 13.81,3.59 14.29,3.1 C_ARR.2
  Top 0.254: C6.2 C7.2 C5.2 6.6,12.19 6.76,12.35 LDO_VREG.GND 8.48,12.35 v8.64,12.19 | C4.1 C3.1 8.89,6.35 | C_ARR.2 C_ARR.4 C_ARR.6 C_ARR.8 | 9.65,5.32 C10.1 | FB1.2 6.01,4.66 EPSON_TSX1.2 | C8.1 1.98,1.52 C9.1 0.89,0.94 v0.58,0.94 | BTN_BOOT.2 10.49,1.45 C1.2
  Route2 0.254: C1.2 8.38,3.56 7.88,3.56 EPSON_TSX1.2 | v17.53,13.21 15.11,10.79 v15.11,8.13 13.97,8.13 13.21,7.37 10.67,7.37 10.03,6.73 8.51,6.73 EPSON_TSX1.4
  Bottom 0.254: PIN_1X14.P$2 2.92,12.32 3.68,11.56 | 3.68,11.56 8,11.56 v8.64,12.19 | 6.48,5.71 4.19,5.71 | 4.19,5.71 3.68,6.22 3.68,11.56 | EPSON_TSX1.2 6.78,5.41 6.48,5.71 | 4.19,5.71 PIN_1X5.P$1 3.68,1.27 3.3,1.65 1.29,1.65 v0.58,0.94 | EPSON_TSX1.4 8.38,6.6 7.49,5.71 6.48,5.71
  other vias: 6.78,4.66 8.38,6.86 9.14,2.79
  pour Bottom (isolate 0.254): 0.25,14.99 20.32,14.99 20.32,0.25 0.25,0.25
  pour Top (isolate 0.254): 0.25,14.99 20.32,14.99 20.32,0.25 0.25,0.25
N$3
  Top 0.203: R5.1 5.59,7.62
  Top 0.254: MICRO_B_USB.4 4.52,7.42 R6.1 5.59,7.62
N$26  (via drill 0.2 pad 0.51)
  Top 0.152: SJ_RESET.1 v0.58,2.16
  Top 0.254: R1.1 4.06,3.35 3.91,3.5 v2.54,3.5
  Bottom 0.254: v2.54,3.5 0.91,3.5 0.61,3.2 0.61,2.26 v0.58,2.16
N$32
  Top 0.152: MICRO_B_USB.7 1.04,11.43 | MICRO_B_USB.6 3.59,11.43 | 1.56,4.33 MICRO_B_USB.10 | 1.14,6.78 MICRO_B_USB.9
  Top 0.254: MICRO_B_USB.5 1.14,6.78 | FB1.1 4.83,3.56 4.19,4.19 4.19,4.38 MICRO_B_USB.11
  Top 0.406: 4.19,4.19 3.59,4.19 3.59,4.32
  Top 0.61: 1.04,11.43 MICRO_B_USB.8 MICRO_B_USB.9 MICRO_B_USB.10 1.28,4.32 3.59,4.32 | 3.59,11.43 3.56,11.43 3.3,11.68 1.43,11.68 MICRO_B_USB.7
PA00/X32IN  (via drill 0.2 pad 0.51)
  Top 0.152: v19.43,5.08 18.54,5.97 18.54,7.49 18.39,7.65 IC1.1 16.74,7.65 v16.46,7.92 | OSC32K.1 10.6,6.33 v10.67,6.25 | C10.2
  Top 0.254: v10.67,6.25 C10.2
  Route15 0.254: v19.43,5.08 PIN_1X3.P$1
  Bottom 0.254: v16.46,7.92 16.46,7.54 15.42,6.5 12.7,6.5 12.29,6.1 10.82,6.1 v10.67,6.25
PA01/X32OUT  (via drill 0.2 pad 0.51)
  Top 0.152: IC1.2 17.15,8.15 v16.54,8.76 | OSC32K.2 12,6.29 v11.96,6.76
  Top 0.254: v11.96,6.76 11.96,5.75 C11.2
  Route2 0.254: v16.54,8.76 17.17,8.13 17.4,8.13 19.18,6.35 PIN_1X6.P$1
  Bottom 0.152: v11.96,6.76 11.96,6.78
  Bottom 0.254: 11.96,6.78 12.57,7.39 15.37,7.39 15.77,7.8 15.77,8.38 16.15,8.76 v16.54,8.76
PA02/AIN[0]
  Top 0.152: IC1.3 18.4,8.65 PIN_1X6.P$2
PA03/VREFA/AIN[1]  (via drill 0.2 pad 0.51)
  Top 0.152: IC1.4 19.17,9.15 PIN_1X6.P$3
  Top 0.254: C_ARR.7 v16.69,4.23
  Route15 0.254: PIN_1X6.P$3 18.67,8.89 16.64,6.86 16.64,4.41 v16.69,4.23
  Bottom 0.254: v16.69,4.23 15.97,4.95 14.1,4.95 13.84,4.7 13.66,4.7 C2.1
  other vias: 13.36,4.39
PA04/AIN[4]
  Top 0.152: IC1.5 18.92,9.65 PIN_1X6.P$4
PA05/AIN[5]
  Top 0.152: IC1.6 18.4,10.15 18.67,10.41 18.67,10.67 PIN_1X6.P$5
PA06/AIN[6]  (via drill 0.2 pad 0.51)
  Top 0.152: IC1.7 17.25,10.65 v16.26,9.65
  Route2 0.254: v16.26,9.65 16.76,10.16 16.76,11.18 18.16,12.57 19.3,12.57 PIN_1X6.P$6
PA07/AIN[7]/I2S/SD[0]
  Top 0.152: IC1.8 17.84,12.25 18.29,12.7 18.29,13.84 PIN_1X14.P$14
PA08/I2S/SD1/I2C  (via drill 0.2 pad 0.51)
  Top 0.152: PIN_1X14.P$13 15.99,13.07 IC1.11 16,11.99 16,11.3 15.75,11.05 14.73,11.05 v14.61,10.92
  Bottom 0.254: v14.61,10.92 14.73,11.05 16.26,11.05 17.27,10.03 17.27,6.99 16.76,6.48 16.76,5.08 17.4,4.45 17.4,3.94 17.02,3.56 13.08,3.56 R4.1
  other vias: 12.45,2.92
PA08_R  (via drill 0.2 pad 0.51)
  Top 0.254: RGBLED.2 19.86,3.26 20.07,3.05 v20.07,2.16
  Bottom 0.254: v20.07,2.16 20.07,3.3 19.43,3.94 18.16,3.94 17.14,2.92 R4.2
  other vias: 13.46,2.92
PA09/I2S/MCK0/I2C  (via drill 0.2 pad 0.51)
  Top 0.152: IC1.12 15.49,13.84 PIN_1X14.P$12
  Route2 0.254: R3.1 10.03,2.92 8.76,4.19 8.76,5.08 7.62,6.22 7.62,8.26 8.13,8.76 12.32,8.76 12.7,9.14 12.7,10.79 13.84,11.94 15.05,11.94 15.49,12.38 15.49,13.84 PIN_1X14.P$12
  other vias: 10.41,2.92
PA09_G  (via drill 0.2 pad 0.51)
  Top 0.254: R3.2 11.43,2.03 v11.68,1.78
  Bottom 0.254: v11.68,1.78 11.81,1.65 12.95,1.65 13.46,2.16 17.53,2.16 RGBLED.3
  other vias: 18.62,3.26
PA10/I2S/SCK0
  Top 0.152: IC1.13 14.99,12.95 14.35,13.59 PIN_1X14.P$11
PA11/I2S/FS0
  Top 0.152: IC1.14 14.49,12.69 14.22,12.95 14.1,12.95 PIN_1X14.P$10
PA14/XIN  (via drill 0.2 pad 0.51)
  Top 0.152: EPSON_TSX1.1 v6.86,6.86 | v14.1,10.29 13.99,10.43 IC1.15
  Route2 0.254: v14.1,10.29 13.34,9.53 13.34,8.76 12.7,8.13 10.41,8.13 C3.2
  Bottom 0.254: v6.86,6.86 6.86,7.37 7.37,7.87 9.14,7.87 C3.2
  other vias: 9.65,7.37
PA15/XOUT  (via drill 0.2 pad 0.51)
  Top 0.152: 8.72,4.32 EPSON_TSX1.3 | IC1.16 13.49,12.54 13.34,12.7 12.83,12.7 v12.7,12.83
  Top 0.305: C4.2 8.72,4.32
  Route15 0.254: v12.7,12.83 11.94,12.83 11.43,12.32 11.43,7.95 9.65,6.17 C4.2
  other vias: 9.65,4.32
PA16/SERCOM1/PAD[0]/SPI/I2C
  Top 0.152: IC1.17 12.09,11.15 11.94,11.3 11.94,13.84 PIN_1X14.P$9
PA17/SERCOM1/PAD[1]/SPI/I2C
  Top 0.152: IC1.18 11.96,10.65 11.43,11.18 11.43,11.68 10.92,12.19 10.29,12.19 10.03,12.45 R7.1 10.03,13.46 PIN_1X14.P$8
PA17_B  (via drill 0.2 pad 0.51)
  Top 0.152: RGBLED.4 18.67,4.15
  Top 0.254: 18.67,4.15 v18.67,4.95
  Bottom 0.254: R7.2 11.81,12.19 13.08,12.19 13.72,12.83 16.89,12.83 17.27,12.45 18.03,12.45 18.29,12.19 18.29,5.33 v18.67,4.95
  other vias: 11.05,12.95
PA18/SERCOM1/PAD[2]/SPI  (via drill 0.2 pad 0.51)
  Top 0.152: IC1.19 11.7,10.15 11.18,10.67 v10.67,10.67
  Route2 0.254: v10.67,10.67 10.29,11.05 10.29,12.45 9.4,13.34 9.4,13.84 PIN_1X14.P$7
PA19/SERCOM1/PAD[3]/SPI  (via drill 0.2 pad 0.51)
  Top 0.152: IC1.20 11.43,9.65 11.04,10.05 10.02,10.05 v9.65,10.41
  Route2 0.254: v9.65,10.41 9.65,12.19 8.89,12.95 8.38,12.95 8.13,13.21 8.13,13.84 PIN_1X14.P$6
PA22/I2C  (via drill 0.2 pad 0.51)
  Top 0.152: IC1.21 11.17,9.15 10.67,9.65 v9.4,9.65
  Route2 0.254: v9.4,9.65 7.87,9.65 7.37,10.16 7.37,11.94 6.6,12.7 6.6,13.84 PIN_1X14.P$5
PA23/USB/SOF1KHZ/I2C  (via drill 0.2 pad 0.51)
  Top 0.152: IC1.22 10.91,8.65 10.41,9.14 7.37,9.14 v7.11,9.4
  Route2 0.254: v7.11,9.4 6.35,10.16 6.35,11.94 5.59,12.7 5.59,13.84 PIN_1X14.P$4
PA24/USBDM
  Top 0.152: MICRO_B_USB.2 10.08,8.72 10.65,8.15 IC1.23
PA25/USBDP
  Top 0.152: IC1.24 10.39,7.65 9.91,8.13 3.76,8.13 MICRO_B_USB.3
PA27  (via drill 0.2 pad 0.51)
  Top 0.152: IC1.25 13.49,6.12 13.28,5.92 v13.08,5.92
  Route2 0.254: PIN_1X3.P$3 14.35,3.81 13.08,3.81 12.83,4.06 12.83,5.46 13.08,5.71 v13.08,5.92
  Bottom 0.254: BTN_BOOT.1 14.35,1.14 14.86,1.65 16.51,1.65 PIN_1X3.P$3
  other vias: 13.89,1.14
PA28  (via drill 0.2 pad 0.51)
  Top 0.152: IC1.27 14.49,8.78 v14.61,8.89
  Route2 0.254: v14.61,5.59 14.61,5.31 14.99,4.93 14.99,4.06 16.89,2.16 17.53,2.16 18.16,1.52 PIN_1X3.P$2
  Route15 0.254: v14.61,8.89 v14.61,5.59
  Bottom 0.254: R5.2 5.71,8 6.48,8.76 14.48,8.76 v14.61,8.89
  other vias: 5.71,6.6
PA30/SWCLK  (via drill 0.2 pad 0.51)
  Top 0.152: IC1.31 16.49,5.74 16.76,5.46 17.14,5.46 v17.4,5.21
  Route15 0.254: v17.4,5.21 17.4,3.81 16.51,2.92 14.48,2.92 13.89,2.34 11.1,2.34 10.92,2.16 8.38,2.16 8.26,2.03 8.26,1.52 PIN_1X5.P$4
PA31/SWDIO  (via drill 0.2 pad 0.51)
  Top 0.152: IC1.32 16.99,6.25 17.14,6.1 v17.53,6.1
  Route15 0.254: v17.53,6.1 18.03,5.59 18.03,2.54 17.65,2.16 15.88,2.16 14.22,0.51 12.06,0.51 11.3,1.27 PIN_1X5.P$5
RESET  (via drill 0.2 pad 0.51)
  Top 0.152: IC1.26 13.99,5.56 13.75,5.32 v13.58,5.32
  Top 0.254: R1.2 R2.1
  Route2 0.254: R2.1 6.1,2.41 6.35,2.16 | 6.35,2.16 6.35,1.65 PIN_1X5.P$3 | C1.1 7.49,2.16 6.35,2.16
  Bottom 0.254: v13.58,5.32 8.51,5.32 8.13,4.93 C1.1
  other vias: 6.1,2.67 8.13,2.79
VDDANA  (via drill 0.2 pad 0.51)
  Top 0.152: IC1.9 16.99,11.15 16.26,10.41 v15.75,10.41
  Top 0.254: C9.2 2.85,2.54 L1.2
  Route15 0.254: v15.75,10.41 15.75,5.81 C_ARR.1 14.29,4.24 13.87,3.81 10.13,3.81 9.83,3.5 3.73,3.5 3.05,2.82 L1.2
  other vias: 14.29,4.36 3.05,2.34
VDDCORE
  Top 0.152: IC1.29 15.49,5.58 15.11,5.21 15.11,4.38 C_ARR.3
VIN  (via drill 0.2 pad 0.51)
  Top 0.254: LDO_VREG.VIN 9.12,11.41 v8.89,11.18
  Top 0.356: MICRO_B_USB.1 4.8,9.38 C6.1 C7.1
  Route15 0.254: PIN_1X14.P$1 1.52,13.84 1.52,12.45 2.03,11.94 4.19,11.94 5.08,11.05 C6.1
  Bottom 0.254: C6.1 5.08,10.54 5.33,10.79 5.46,10.92 8.64,10.92 v8.89,11.18
  other vias: 5.08,9.65

### Text on the board
tNames: H
bNames: VIN | GND | 3V3 | SCL | SDA | MISO | SS | SCK | MOSI | TX | D3 | D4 | A2 | RX | A1 | A4 | A3 | femto.io | r1.0.1 | AREF | A0 | FemtoUSB | D6 | SWCLK | SWDIO | GND | 3V3 | RESET | D5 | D22 | D2